# EAGLE design SaturnPSU_1.5 (EAGLE 9.4.2)
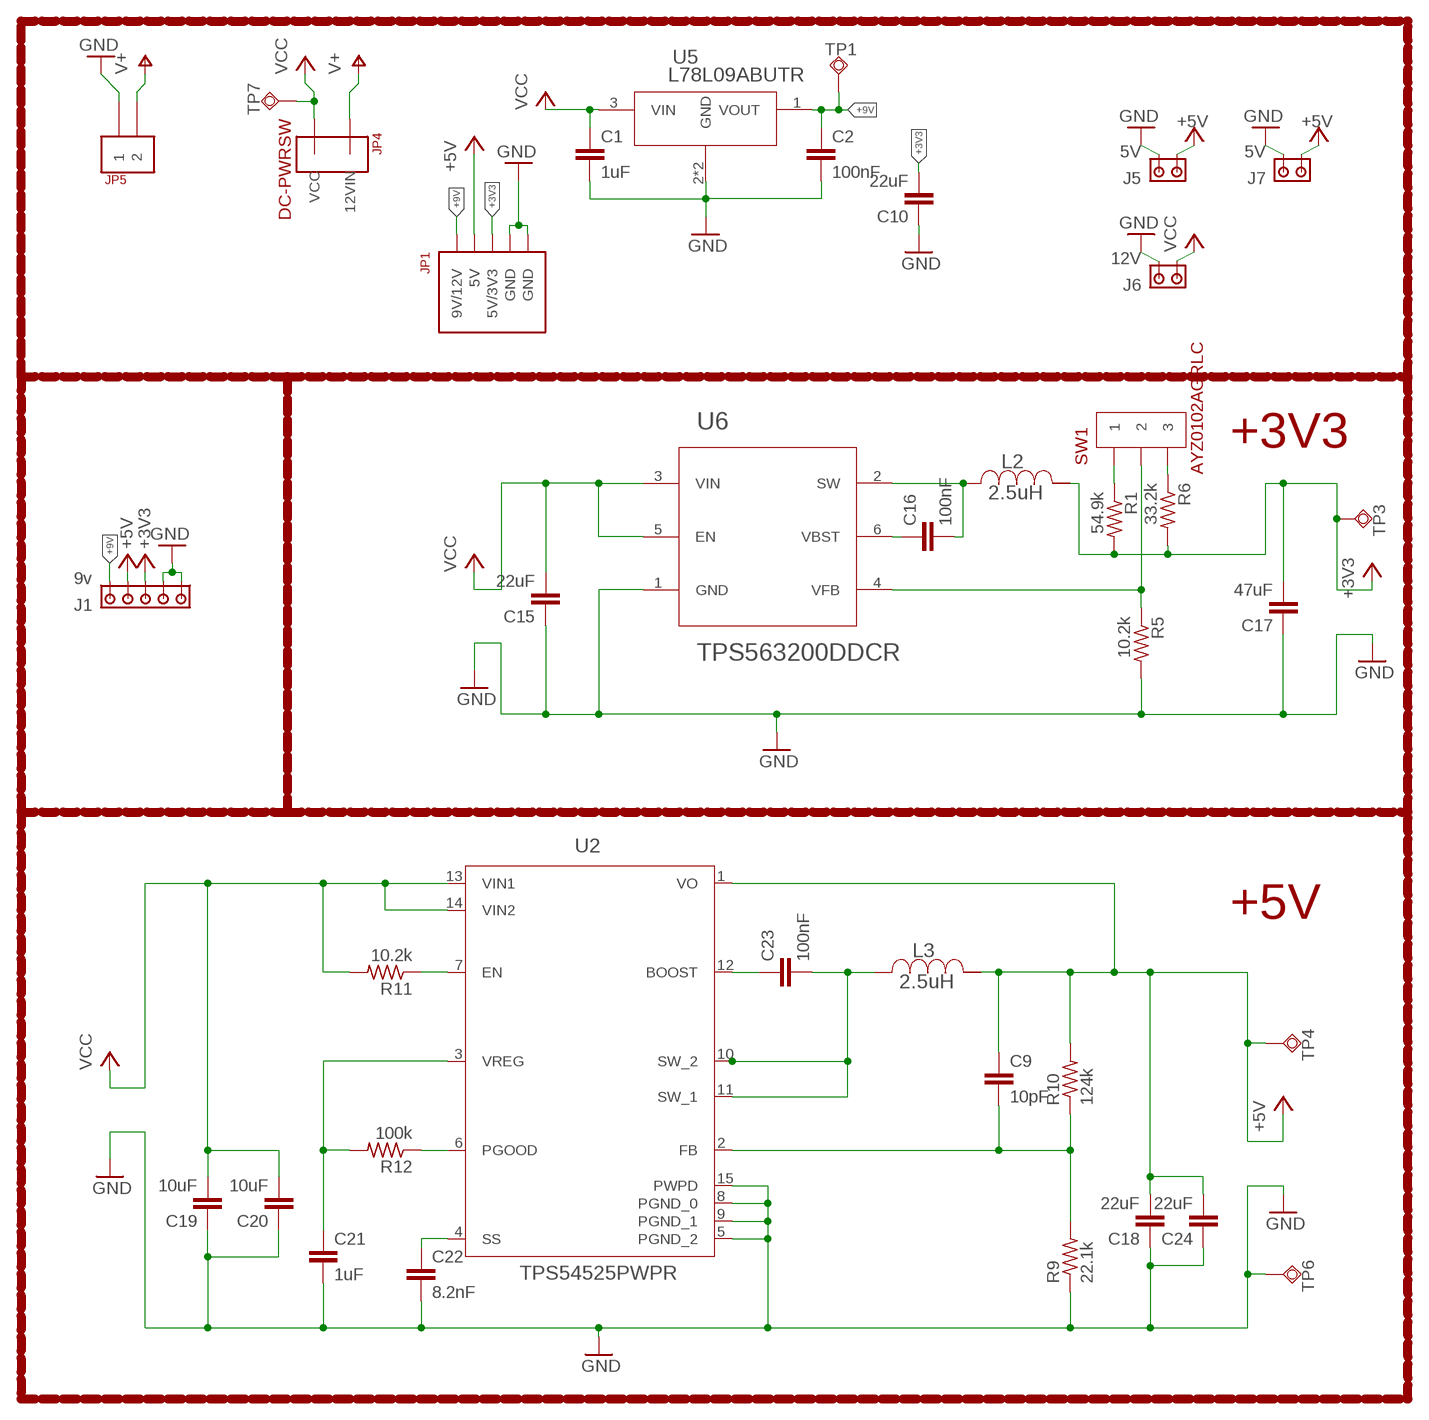
[diagram p0: schematic, sheet 1]

## Parts
C1  1uF  CAPACITORC0603  [C0603]
C2  100nF  CAPACITORC0603  [C0603]
C9  10pF  CAPACITORC0603  [C0603]
C10  22uF  CAPACITORC0805  [C0805]
C15  22uF  CAPACITORC0805  [C0805]
C16  100nF  CAPACITORC0603  [C0603]
C17  47uF  C-EUC1206  [C1206]
C18  22uF  CAPACITORC0805  [C0805]
C19  10uF  CAPACITORC1206  [C1206]
C20  10uF  CAPACITORC1206  [C1206]
C21  1uF  CAPACITORC0603  [C0603]
C22  8.2nF  CAPACITORC0603  [C0603]
C23  100nF  CAPACITORC0603  [C0603]
C24  22uF  CAPACITORC0805  [C0805]
J1  9v  KF2510-5A-2.54MM  [KF2510-5A-2.54MM]
J5  5V  6030916A  [6030916A]
J6  12V  6030916A  [6030916A]
J7  5V  6030916A  [6030916A]
JP1  MOLEX-5PIN-09-48-3054  [09-48-3054]
JP4  DC-PWRSW  DC-POWERSWITCH-1-1123724-2  [1-1123724-2]
JP5  640445-2_3.96MM-2PIN-HEADER  [640445-2_3.96MM-2PIN-HEADER]
L2  2.5uH  PA4341.252NLT  [PA4341.252NLT]
L3  2.5uH  PA4341.252NLT  [PA4341.252NLT]
R1  54.9k  R-US_R0603  [R0603]
R5  10.2k  R-US_R0603  [R0603]
R6  33.2k  R-US_R0603  [R0603]
R9  22.1k  R-US_R0603  [R0603]
R10  124k  R-US_R0603  [R0603]
R11  10.2k  R-US_R0603  [R0603]
R12  100k  R-US_R0603  [R0603]
SW1  AYZ0102AGRLC  [AYZ0102AGRLC]
TP1  TPSQB1,27  [B1,27]
TP3  TPSQB1,27  [B1,27]
TP4  TPSQB1,27  [B1,27]
TP6  TPSQB1,27  [B1,27]
TP7  TPSQB1,27  [B1,27]
U2  TPS54525PWPR  TPS54625PWPR  [R-PDSO-G14]
U5  L78L09ABUTR  [SOT-89]
U6  TPS563200DDCR  [DDC0006A]

## Nets
2: C23.2 L3.P$1 U2.10(SW_2) U2.11(SW_1)
+3V3: C10.2 C17.2 J1.3 JP1.3(5V/3V3) L2.P$2 R1.2 R6.2 TP3.TP
+5V: C9.1 C18.2 C24.2 J1.4 J5.POWER J7.POWER JP1.4(5V) L3.P$2 R10.2 TP4.TP U2.1(VO)
+9V: C2.1 J1.5 JP1.5(9V/12V) TP1.TP U5.1(VOUT)
GND: C1.2 C2.2 C10.1 C15.1 C17.1 C18.1 C19.1 C20.1 C21.2 C22.2 C24.1 J1.1 J1.2 J5.GND J6.GND J7.GND JP1.1(GND) JP1.2(GND) JP5.P$1 R5.2 R9.1 TP6.TP U2.5(PGND_2) U2.8(PGND_0) U2.9(PGND_1) U2.15(PWPD) U5.2(GND) U5.P$1(GND) U6.1(GND)
N$2: R1.1 SW1.1
N$3: R6.1 SW1.3
N$7: C16.2 L2.P$1 U6.2(SW)
N$8: C16.1 U6.6(VBST)
N$9: R5.1 SW1.2 U6.4(VFB)
N$14: R11.1 U2.7(EN)
N$15: C21.1 R12.2 U2.3(VREG)
N$17: R12.1 U2.6(PGOOD)
N$18: C22.1 U2.4(SS)
N$19: C9.2 R9.2 R10.1 U2.2(FB)
N$20: C23.1 U2.12(BOOST)
V+: JP4.12VIN JP5.P$2
VCC: C1.1 C15.2 C19.2 C20.2 J6.POWER JP4.VCC R11.2 TP7.TP U2.13(VIN1) U2.14(VIN2) U5.3(VIN) U6.3(VIN) U6.5(EN)

## Notes on the sheet
- +3V3
- +5V

## Library data of the parts
C1 C2 C9 C10 C15 C16 C18-C24 = DreamPSURev1-9:CAPACITOR: CAPACITOR, European symbol
C17 = resistor:C-EU: CAPACITOR, European symbol
J1 = SaturnPSU_1.5:KF2510-5A-2.54MM: AMP connector
J5-J7 = SaturnPSU_1.4:6030916A: AMP connector
JP1 = SaturnPSU_1.5:MOLEX-5PIN-09-48-3054
JP4 = SaturnPSU_1.5:DC-POWERSWITCH-1-1123724-2
JP5 = SaturnPSU_1.4:640445-2_3.96MM-2PIN-HEADER
L2 = SaturnPSU_1.5:PA4341.252NLT
L3 = SaturnPSU_1.4:PA4341.252NLT
R1 R5 R6 R9-R12 = DreamPSURev1-9:R-US_: RESISTOR, American symbol
SW1 = SaturnPSU_1.5:AYZ0102AGRLC
TP1 TP3 TP4 TP6 TP7 = DreamPSURev1-9:TPSQ: Test pad
U2 = DreamPSURev1-9:TPS54625PWPR; DATASHEETURL: http://www.ti.com/product/tps54225; FREQUENCY: 700000.0; IMAX: 2.0; MANUFACTURER_NAME: Texas Instruments; MANUFACTURER_PART_NUMBER: TPS54225PWP; MKTG_PACKAGE: R-PDSO-G14; NSID: TPS54225PWPR; PACKAGE: R-PDSO-G14; VENDOR: Texas Instruments
U5 = SaturnPSU_1.5:L78L09ABUTR; MANUFACTURER_PART_NUMBER: L78L09ABUTR; VENDOR: ST Microelectronics
U6 = SaturnPSU_1.5:TPS563200DDCR; ADDRESS1: Not shown in title block; ADDRESS2: Not shown in title block; ADDRESS3: Not shown in title block; ADDRESS4: Not shown in title block; ALTERNATEMANUFACTURER: None; APPROVEDBY: Not shown in title block; AUTHOR: Not shown in title block; CHECKEDBY: Not shown in title block; COMPANYNAME: Not shown in title block; COMPONENTLINK1DESCRIPTION: Datasheet Link; COMPONENTLINK1URL: httpssps06.itg.ti.comsitesKMScrossdivteamsaltiumdocsComponentDatasheetsTPS56320xDDC_Users_Guide_v0p1_14_0203.pdf; COMPTYPE: IC; CURRENTDATE: Not shown in title block; CURRENTTIME: Not shown in title block; DATE: Not shown in title block; DESIGNATOR: U?; DOCUMENTFULLPATHANDNAME: Not shown in title block; DOCUMENTNAME: Not shown in title block; DOCUMENTNUMBER: 1; ENGINEER: Not shown in title block; IMAGEPATH: Not shown in title block; LATESTREVISIONDATE: 20140414; MANUFACTURER: Texas Instruments; MANUFACTURER_NAME: Texas Instruments; MANUFACTURER_PART_NUMBER: TPS563200DDCR; MODIFIEDDATE: Not shown in title block; MOUNTTYPE: SMT; ORGANIZATION: Not shown in title block; PACKAGEREFERENCE: DDC0006A; PARTNUMBER: TPS563200DDC; PIN_COUNT: 6; PROJECTNAME: *; PUBLISHER: Texas Instruments; REVISION: Use project parameter SCH_Rev; ROHS: Y; RULE: *; SHEETNUMBER: 1; SHEETTOTAL: 1; SYMBOLCREATOR: a0411947; SYMBOLVERSION: 20140411; TIME: Not shown in title block; UM: EA

## Board
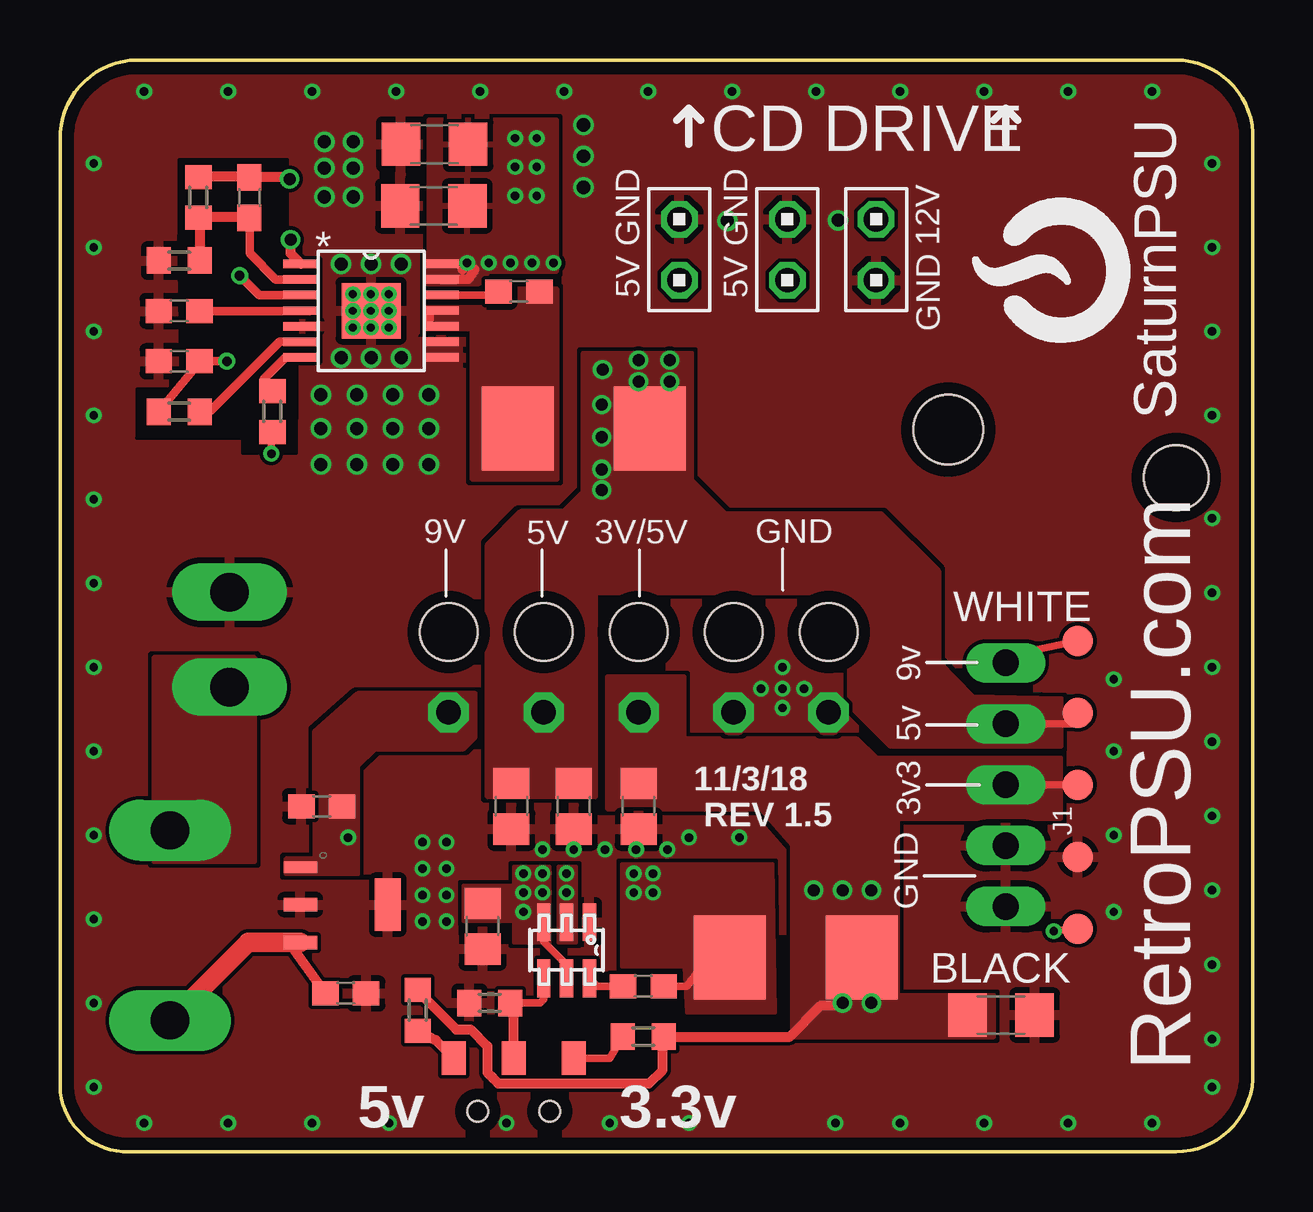
[diagram p1: board, top side]
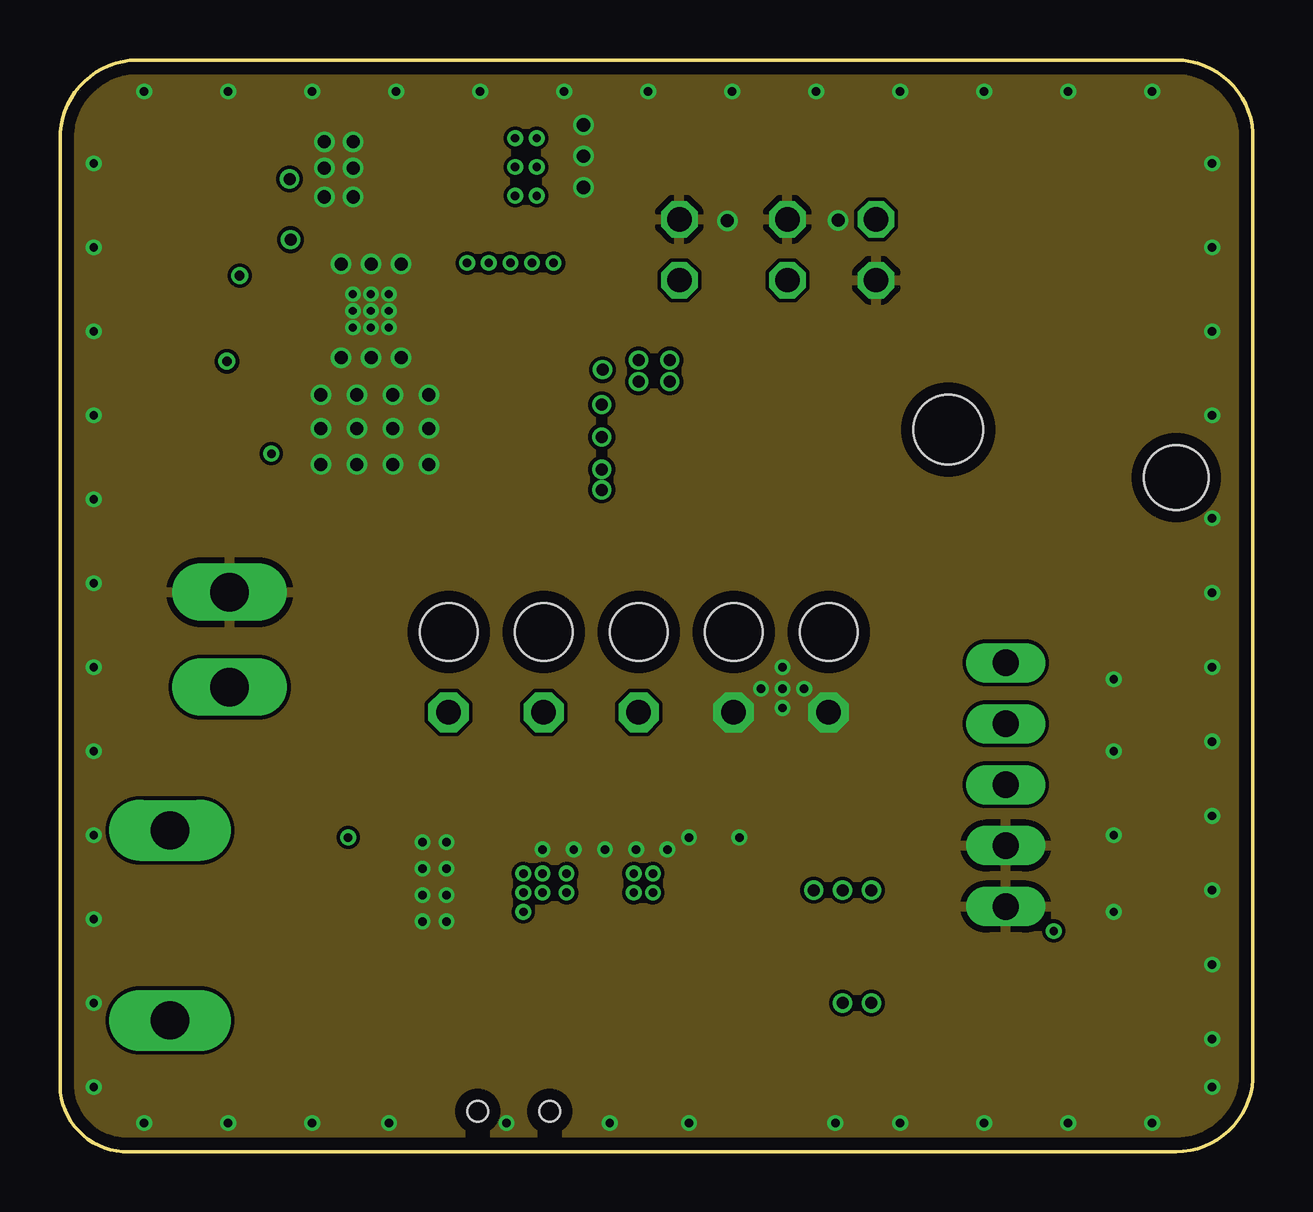
[diagram p2: board, inner layer GND]
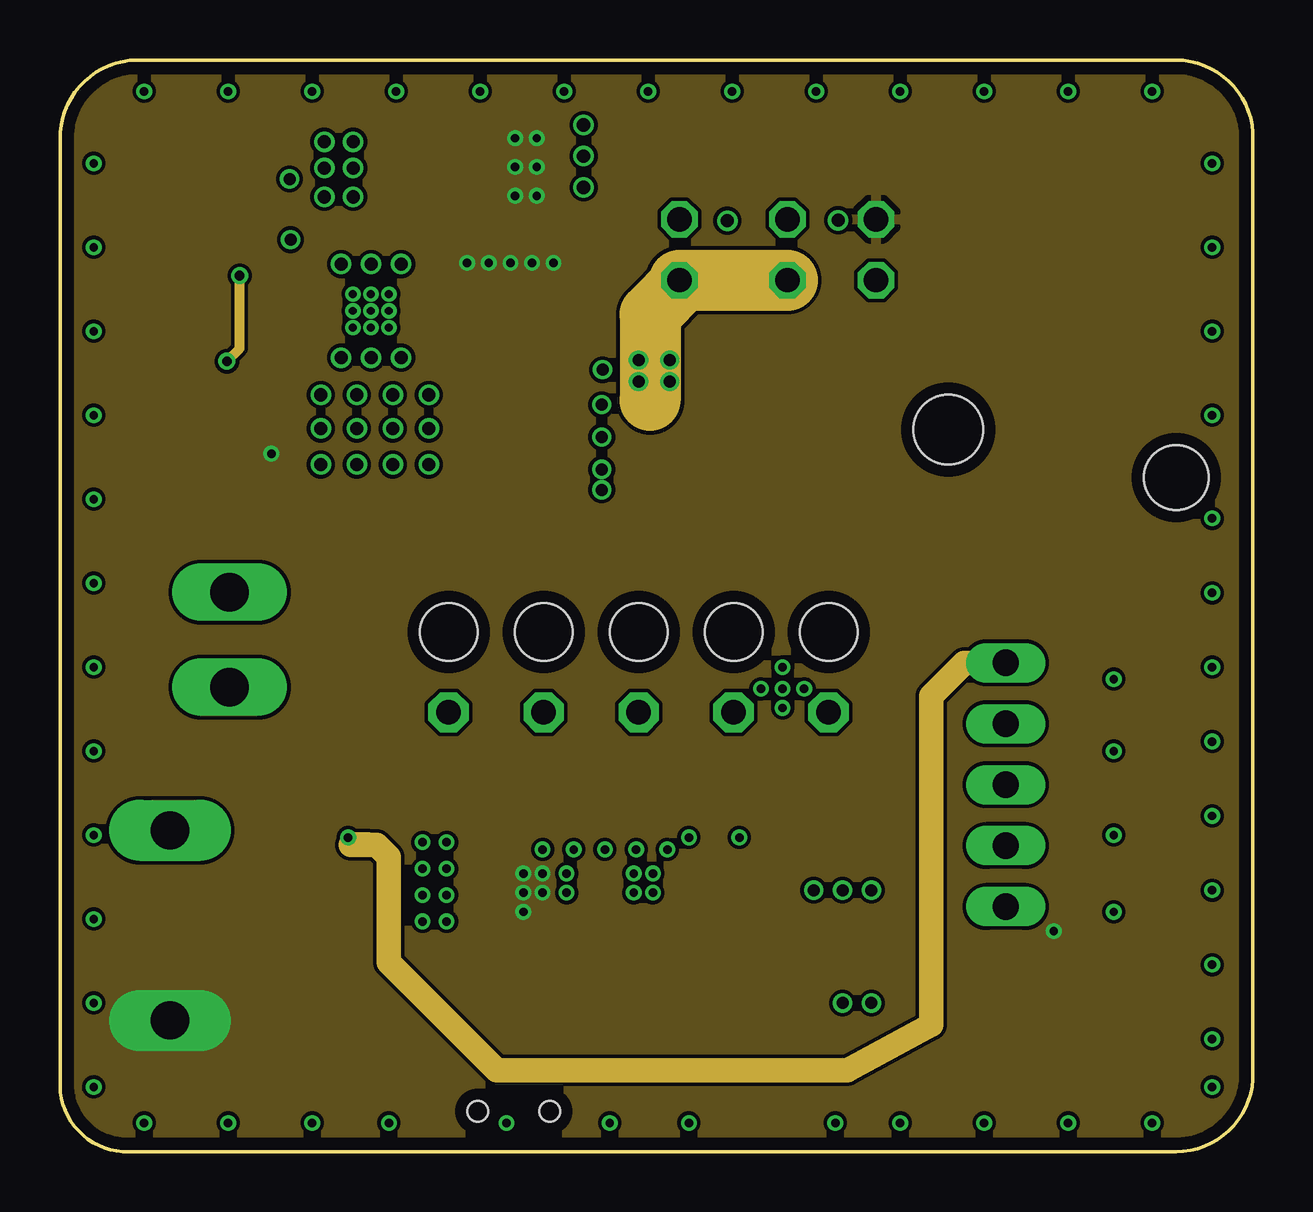
[diagram p3: board, inner layer VCC]
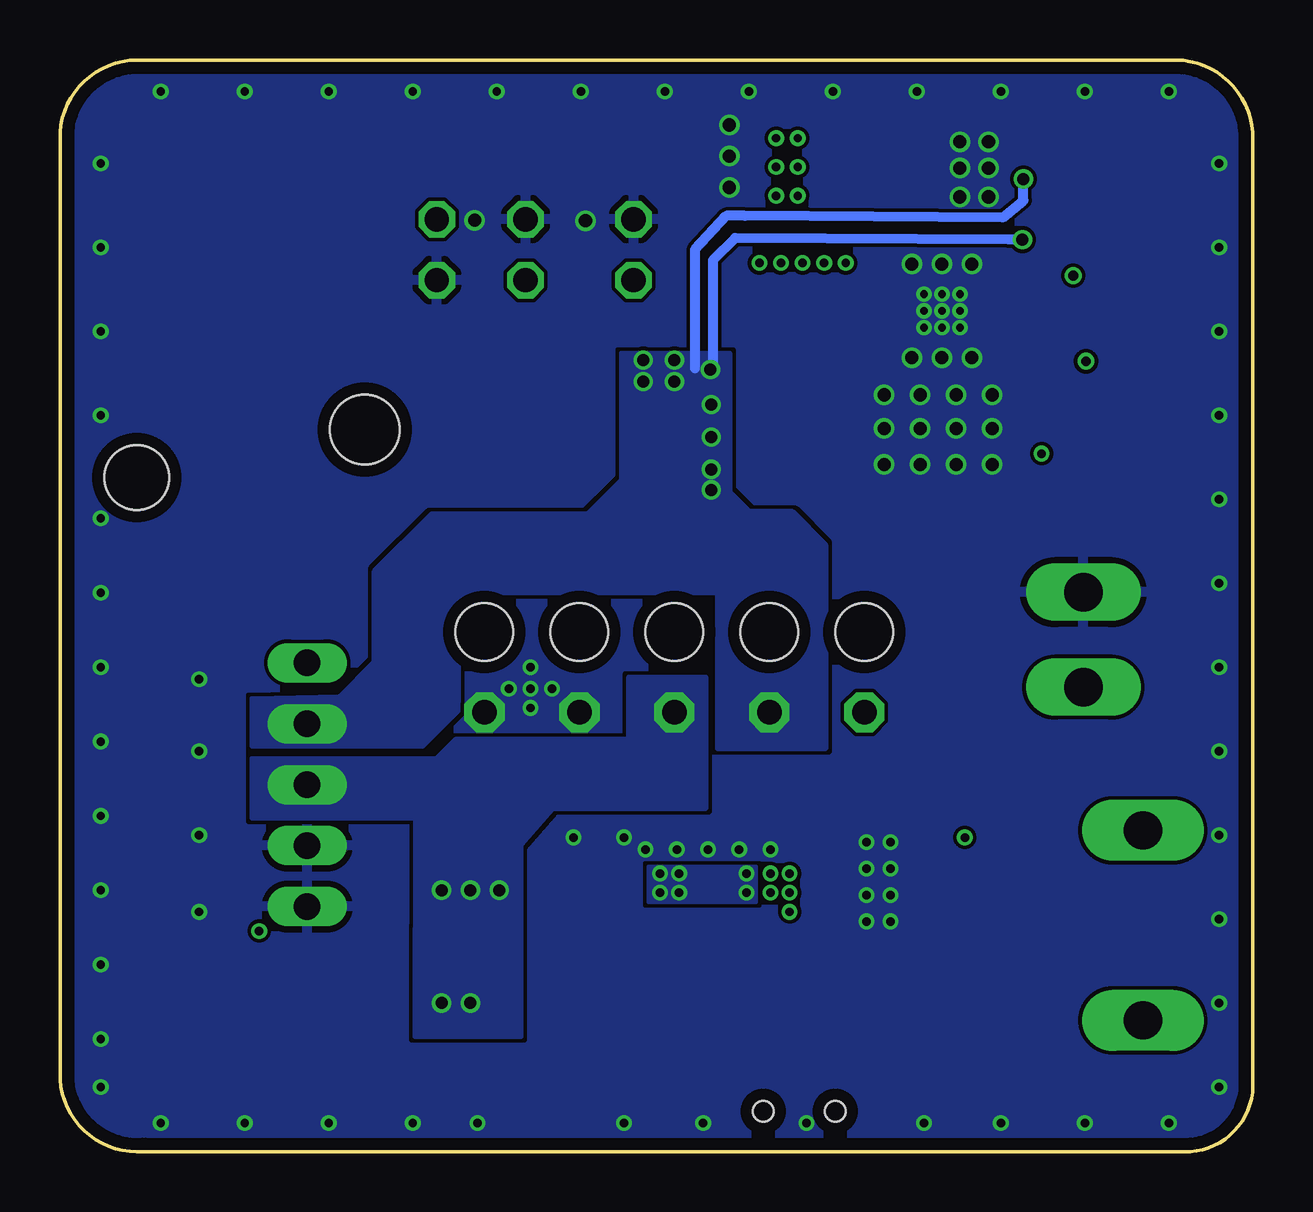
[diagram p4: board, bottom side, seen from below]

Size 49.71 x 45.52 mm. Coordinates in mm from the lower left corner, seen from the top.
Outline: 3.51,45.51 46.21,45.51 arc-90 49.71,42.51 49.71,3.01 arc-90 46.21,0.01 2.61,0.01 arc-90 0.01,3.01 0.01,42.51 arc-90 3.51,45.51
Copper layers (1*2*15*16): Top 0.035mm / dielectric 0.2mm / GND 0.035mm / dielectric 1.2mm / VCC 0.035mm / dielectric 0.2mm / Bottom 0.035mm
Design rules "Elecrow_4-layer_PCB_eagle_rule": minimum track width 6mil, minimum drill 12mil, track to track 6mil, track to pad 6mil, pad to pad 6mil, via to via 8mil, smd to smd 0mil, copper to edge 20mil, drill to drill 10mil, minimum pad ring 6mil, minimum via ring 6mil, stop-mask expansion 0mil, vias tented up to drill 100mil, thermal gap 10mil
Holes 2.9 mm at 37.01,30.11
Holes 2.7 mm at 46.51,28.11

### Footprints (pad centres in the part's own frame; a part is rotated, then mirrored left to right if it is on the bottom)
C0603 = smd 1.1 x 1: 1 -0.85,0; 2 0.85,0
C0805 = smd 1.3 x 1.5: 1 -0.95,0; 2 0.95,0
C1206 = smd 1.6 x 1.8: 1 -1.4,0; 2 1.4,0
KF2510-5A-2.54MM = drill 1.1 long: 1 -5.08,0; 2 -2.54,0; 3 0,0; 4 2.54,0; 5 5.08,0
6030916A = drill 1.016 octagon: GND 1.27,0; POWER -1.27,0
09-48-3054 = drill 1.02 pad 1.676 octagon: 1 5.93,-3.35; 2 1.97,-3.35; 3 -1.98,-3.35; 4 -5.94,-3.35; 5 -9.9,-3.35 | hole 2.4: -9.9,0; -5.94,0; -1.98,0; 1.98,0; 5.94,0
1-1123724-2 = drill 1.6 pad 2.54 long: 12VIN -3.96,0; VCC 3.96,0
640445-2_3.96MM-2PIN-HEADER = drill 1.6 long: P$1 -1.98,0; P$2 1.98,0
PA4341.252NLT = smd 3.5 x 3: P$1 0,2.5; P$2 0,-3
R0603 = smd 1 x 1.1: 1 -0.85,0; 2 0.85,0
AYZ0102AGRLC = smd 1 x 1.4: 1 -2.5,0.2; 2 0,0.2; 3 2.5,0.2 | hole 0.85: -1.5,-2.008; 1.5,-2.008
B1,27 = smd 1.27 x 1.27: TP 0,0
R-PDSO-G14 = smd 1.461 x 0.351: 1 -2.925,1.95; 2 -2.925,1.3; 3 -2.925,0.65; 4 -2.925,0; 5 -2.925,-0.65; 6 -2.925,-1.3; 7 -2.925,-1.95; 8 2.925,-1.95; 9 2.925,-1.3; 10 2.925,-0.65; 11 2.925,0; 12 2.925,0.65; 13 2.925,1.3; 14 2.925,1.95 | smd 2.46 x 2.31: 15 0,0
SOT-89 = smd 0.483 x 1.397: 1 -1.57,-1.994 | smd 0.559 x 1.397: 2 0,-1.994; 3 1.574,-1.994 | smd 2.184 x 1.067: P$1 0,1.651
DDC0006A = smd 1.575 x 0.559: 1 -1.168,0.95; 2 -1.168,0; 3 -1.168,-0.95; 4 1.168,-0.95; 5 1.168,0; 6 1.168,0.95

### Placement (x,y rotation side)
C1  11.91,6.61 0 top
C2  10.91,14.41 180 top
C9  7.89,39.78 270 top
C10  24.11,14.41 90 top
C15  17.61,9.41 90 top
C16  24.31,6.91 0 top
C17  39.21,5.71 180 top
C18  21.41,14.41 90 top
C19  15.61,42.01 0 top
C20  15.58,39.44 0 top
C21  4.97,32.96 180 top
C22  4.97,35.06 180 top
C23  19.12,35.87 0 top
C24  18.81,14.41 90 top
J1  39.41,15.31 90 top
J5  25.81,37.61 90 top
J6  34.01,37.61 270 top
J7  30.31,37.61 90 top
JP1  26.09,21.67 0 top
JP4  4.58,9.45 270 top
JP5  7.07,21.36 270 top
L2  30.41,8.11 90 top
L3  21.57,30.16 90 top
R1  14.91,5.91 90 top
R5  17.91,6.21 180 top
R6  24.31,4.81 0 top
R9  4.97,37.16 0 top
R10  5.77,39.79 90 top
R11  8.85,30.87 270 top
R12  4.97,30.86 180 top
SW1  18.91,3.71 0 top
TP1  42.41,21.31 0 top
TP3  42.41,15.31 0 top
TP4  42.41,18.31 90 top
TP6  42.41,12.31 90 top
TP7  42.41,9.31 0 top
U2  12.97,35.07 0 top
U5  12.01,10.31 270 top
U6  21.11,8.41 270 top

### Tracks (layer width: path | path; a pad name or v marks a point on that pad's centre or on a via)
2
  Top 0.406: 15.36,34.96 15.36,34.65
  pour Top (isolate 0.254, no thermals): 20.72,28.05 20.72,35.96 19.01,35.96 19.01,35.36 17.17,35.38 17.17,32.31 17.16,28.06
  pour Top (no thermals): 17.66,34.31 15.26,34.31 15.26,35.21 17.66,35.21
+3V3  (via drill 0.5)
  Top 0.305: TP3.TP J1.3
  Top 0.406: v32.61,6.21 32.51,6.11 31.71,6.11 30.41,4.81 R6.2 25.11,4.81 25.11,3.41 24.55,2.85 18.26,2.85 18.05,3.06 18.05,3.07 17.81,3.31 17.81,4.41 17.11,5.1 16.51,5.1 15.25,6.36 R1.2
  other vias: 31.41,10.91 33.81,10.91 32.61,10.91 33.81,6.21
  pour Top (isolate 0.254, no thermals): 30.51,4.81 38.91,4.81 38.91,6.51 34.91,6.51 34.91,13.91 41.71,13.91 41.71,16.41 34.01,16.42 33.21,17.21 26.01,17.21 26.01,19.81 22.81,19.81 22.81,14.31 29.21,14.31 30.51,12.81
  pour Bottom (no thermals): 30.51,4.81 34.91,4.81 34.89,13.9 41.71,13.91 41.71,16.41 34.01,16.41 33.21,17.21 26.01,17.21 26.01,19.81 22.81,19.81 22.81,14.31 29.21,14.31 30.51,12.81
+5V  (via drill 0.5)
  Top 0.305: TP4.TP 42.47,17.85 J1.4
  Top 0.406: U2.1 9.6,37.46 v9.61,38.03 | R10.2 5.5,40.66 7.52,40.66 C9.1 9.5,40.63 v9.57,40.56
  VCC 0.508: 24.59,34.91 24.29,32.31 v24.11,32.11
  VCC 2.54: J7.POWER J5.POWER 26.02,36.34 24.59,34.91 24.59,31.33
  Bottom 0.406: v9.61,38.03 10.19,38.03 21.57,38.1 22.51,37.17 22.51,32.66 | v9.57,40.56 9.57,39.66 10.43,38.95 21.17,39.03 21.94,39.03 23.26,37.61 23.26,32.66
  other vias: 22.57,27.6 22.57,28.45 22.57,29.8 22.57,31.15 22.61,32.61 25.41,32.11 24.11,33.01 25.41,33.01
  pour Top (no thermals): 17.81,14.81 17.81,25.31 19.21,26.71 21.01,26.71 21.81,27.51 21.81,33.31 26.31,33.31 26.31,28.01 27.71,26.61 34.21,26.61 36.61,24.21 36.61,20.42 38.02,18.98 41.71,18.91 41.71,16.91 34.61,16.91 32.91,18.61 32.91,21.71 31.31,23.31 22.31,23.31 22.31,14.81
  pour Bottom (no thermals): 22.31,16.81 22.31,23.31 31.31,23.31 33.11,21.51 33.11,18.41 34.61,16.91 41.71,16.91 41.71,18.91 38.02,18.98 36.61,20.42 36.61,24.21 34.21,26.61 27.71,26.61 26.31,28.01 26.31,33.31 21.81,33.31 21.81,27.51 21.01,26.71 19.21,26.71 17.81,25.31 17.81,16.81
+9V  (via drill 0.35)
  Top 0.305: TP1.TP 40.03,20.81 J1.5
  VCC 0.406: 13.21,12.81 12.91,13.11 v12.01,13.11
  VCC 1.016: J1.5 37.69,20.39 36.31,19.01 36.31,5.31 32.81,3.41 18.21,3.41 13.71,7.91 13.71,12.31 13.21,12.81 12.11,12.81
  pour Top (no thermals): 17.31,19.11 12.41,19.11 10.59,17.5 10.61,12.21 9.41,12.21 9.41,11.61 12.41,11.61 12.41,16.11 13.11,16.81 16.81,16.81 17.31,17.31
GND  (via drill 0.33, 0.35, 0.55)
  other vias: 12.21,35.76 12.21,34.36 13.71,34.36 13.71,35.76 10.87,28.66 10.87,30.16 10.87,31.56 12.37,28.66 12.37,30.16 12.37,31.56 13.87,28.66 13.87,30.16 13.87,31.56 15.37,28.66 15.37,30.16 15.37,31.56 12.97,33.11 11.72,33.11 14.22,33.11 11.02,39.81 11.02,41.01 11.02,42.11 12.22,39.81 12.22,41.01 12.22,42.11 12.96,35.06 12.96,34.36 12.96,35.76 12.21,35.06 13.71,35.06 12.97,37.01 11.72,37.01 14.22,37.01 15.11,12.91 16.11,12.91 16.11,10.71 22.71,12.61 24.01,12.61 15.11,10.71 15.11,11.81 18.61,1.21 22.91,1.21 45.51,1.21 1.41,2.71 3.51,44.21 21.82,42.81 21.82,41.51 21.82,40.21 27.81,38.82 32.43,38.84 48.01,2.71 16.11,11.81 20.11,12.61 21.41,12.61 25.31,12.61 42.01,1.21 38.51,1.21 35.01,1.21 32.31,1.21 26.21,1.21 13.71,1.21 10.51,1.21 7.01,1.21 3.51,1.21 1.41,6.21 1.41,9.71 1.41,13.21 1.41,16.71 1.41,20.21 1.41,23.71 1.41,27.21 1.41,30.71 1.41,34.21 1.41,37.71 1.41,41.21 7.01,44.21 10.51,44.21 14.01,44.21 17.51,44.21 21.01,44.21 24.51,44.21 28.01,44.21 31.51,44.21 35.01,44.21 38.51,44.21 42.01,44.21 45.51,44.21 43.91,10.01 43.91,13.21 43.91,16.71 43.91,19.71 48.01,23.31 48.01,26.41 48.01,30.71 48.01,34.21 48.01,37.71 48.01,41.21 26.21,13.11 28.31,13.11 15.11,9.61 16.11,9.61 30.11,20.21 30.11,19.31 30.11,18.51 29.21,19.31 31.01,19.31 48.01,20.21 48.01,17.11 48.01,14.01 48.01,10.91 48.01,7.81 48.01,4.71
  pour Top (no thermals): 16.69,32.56 16.69,33.83 14.57,33.83 14.57,32.56
  pour Bottom (rank 2): -0.34,45.96 50.26,45.96 50.26,-0.54 -0.34,-0.54
  pour Top (rank 2): -3.09,48.71 -3.09,-3.79 53.01,-3.79 53.51,48.71
  pour GND: -2.09,47.71 -2.09,-2.79 52.01,-2.79 52.51,47.71
N$1
  pour GND (rank 2, no thermals): 3.93,20.62 3.93,12.11 8.11,12.11 8.11,20.62
N$2
  Top 0.406: R1.1 15.66,4.66 SW1.1
N$3
  Top 0.305: R6.1 22.91,3.91 SW1.3
N$7  (via drill 0.35)
  Top 0.305: C16.2 26.11,6.91 26.81,7.81 L2.P$1
  other vias: 21.11,11.61 23.91,11.61 23.91,10.81 24.71,11.61 24.71,10.81 21.11,10.81
  pour Bottom (no thermals): 20.71,11.91 25.21,11.91 25.21,10.41 20.71,10.41
  pour Top (no thermals): 20.76,8.71 20.76,11.91 21.51,11.91 21.51,8.71
  pour Top (no thermals): 23.41,12.01 29.71,12.01 29.81,5.81 26.11,5.81 26.01,7.71 23.41,7.71
N$8
  Top 0.305: U6.6 22.39,6.91 C16.1
N$9
  Top 0.305: R5.1 20.01,6.21 20.16,6.36 U6.4
  Top 0.406: SW1.2 18.91,5.96 R5.1
N$14
  Top 0.35: R11.1 8.49,31.69 8.49,32.22 9.39,33.12 U2.7
N$15  (via drill 0.4)
  Top 0.35: v7.49,36.53 8.3,35.72 U2.3 | R12.2 5.53,32.58 5.53,32.95 5.55,32.96 v6.96,32.96
  Top 0.406: C21.1 5.53,32.95
  VCC 0.406: v6.96,32.96 7.49,33.49 v7.49,36.53
N$17
  Top 0.35: U2.6 9.16,33.77 6.25,30.86 R12.1
N$18
  Top 0.35: C22.1 7.01,35.06 7.66,35.05 10.41,35.05 U2.4
N$19
  Top 0.35: U2.2 9,36.37 7.9,37.47 7.9,39.22
  Top 0.406: 7.9,39.22 C9.2 | 7.62,38.96 5.59,38.96 | R10.1 5.82,38.79 R9.2
  Top 0.61: C9.2 7.62,38.96 | 5.59,38.96 R10.1
N$20
  Top 0.305: 18.42,35.72 U2.12
  Top 0.406: C23.1 18.42,35.72
N$21
  cutout Top: 3.22,31.79 3.21,29.83 3.21,29.76 7.61,29.76 7.61,29.14 9.84,29.14 9.91,37.56 9.47,37.56 9.47,41.36 4.97,41.36 4.97,38.21 4.96,38.21 5.06,31.82
V+
  pour VCC (rank 2, no thermals): 3.91,20.61 3.91,12.11 8.11,12.11 8.11,20.61
  pour Top (no thermals): 3.91,20.61 3.91,12.11 8.11,12.11 8.11,20.61
VCC  (via drill 0.35)
  Top 0.305: U6.3 20.16,8.76 21.11,7.81 U6.5 | v8.81,29.11 8.81,29.97 R11.2 | TP7.TP v41.41,9.21
  Top 0.406: 17.28,36.79 17.01,36.39 16.45,36.37 U2.13 | 16.96,37 16.77,36.8 | 9.53,8.74 C1.1
  Top 0.61: U5.3 9.53,8.74
  Top 0.813: JP4.VCC 7.83,8.74 U5.3
  other vias: 18.97,39.86 18.77,37.06 16.97,37.06 19.67,37.06 17.87,37.06 20.57,37.06 18.97,41.06 18.97,42.26 19.87,39.86 19.87,41.06 19.87,42.26 19.31,11.61 20.11,11.61 19.31,10.81 20.11,10.81 19.31,10.01
  pour Top: 15.37,43.01 15.37,36.2 17.61,36.23 17.84,36.71 20.69,36.71 20.69,43.01
  pour Top (no thermals): 15.27,36.18 15.27,37.36 17.44,37.36 17.44,36.18
  pour VCC: -1.09,46.71 -1.09,-1.79 51.01,-1.79 51.51,46.71
  pour Top (no thermals): 20.41,8.71 20.41,11.91 18.91,11.91 18.91,11.11 16.81,11.11 16.81,9.61 18.91,9.61 18.91,8.71

### Text on the board
tPlace: CD DRIVE | SaturnPSU | WHITE | 11/3/18 | REV 1.5 | BLACK | RetroPSU.com | 5v | 3.3v